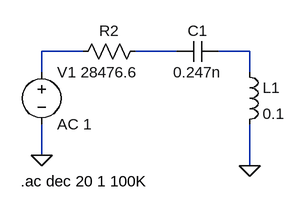
[diagram p0: schematic LTSPICE_LIV2_G7.asc]
LTSPICE_LIV2_G7.asc, the LTspice schematic file:
Version 4
SHEET 1 880 680
WIRE 64 112 0 112
WIRE 208 112 144 112
WIRE 320 112 272 112
WIRE 0 144 0 112
WIRE 320 144 320 112
WIRE 0 272 0 224
WIRE 320 288 320 224
FLAG 320 288 0
FLAG 0 272 0
SYMBOL ind 304 128 R0
SYMATTR InstName L1
SYMATTR Value 0.1
SYMBOL cap 272 96 R90
WINDOW 0 0 32 VBottom 2
WINDOW 3 32 32 VTop 2
SYMATTR InstName C1
SYMATTR Value 0.247n
SYMBOL res 160 96 R90
WINDOW 0 0 56 VBottom 2
WINDOW 3 32 56 VTop 2
SYMATTR InstName R2
SYMATTR Value 28476.6
SYMBOL voltage 0 128 R0
WINDOW 123 0 0 Left 0
WINDOW 39 0 0 Left 0
SYMATTR InstName V1
SYMATTR Value AC 1
TEXT -32 312 Left 2 !.ac dec 20 1 100K

The netlist it stands for:
* LTSPICE_LIV2_G7.asc
L1 N003 0 0.1
C1 N003 N002 0.247n
R2 N002 N001 28476.6
V1 N001 0 AC 1
.ac dec 20 1 100K
.backanno
.end